# EAGLE design sensormatic (EAGLE 9.5.0)
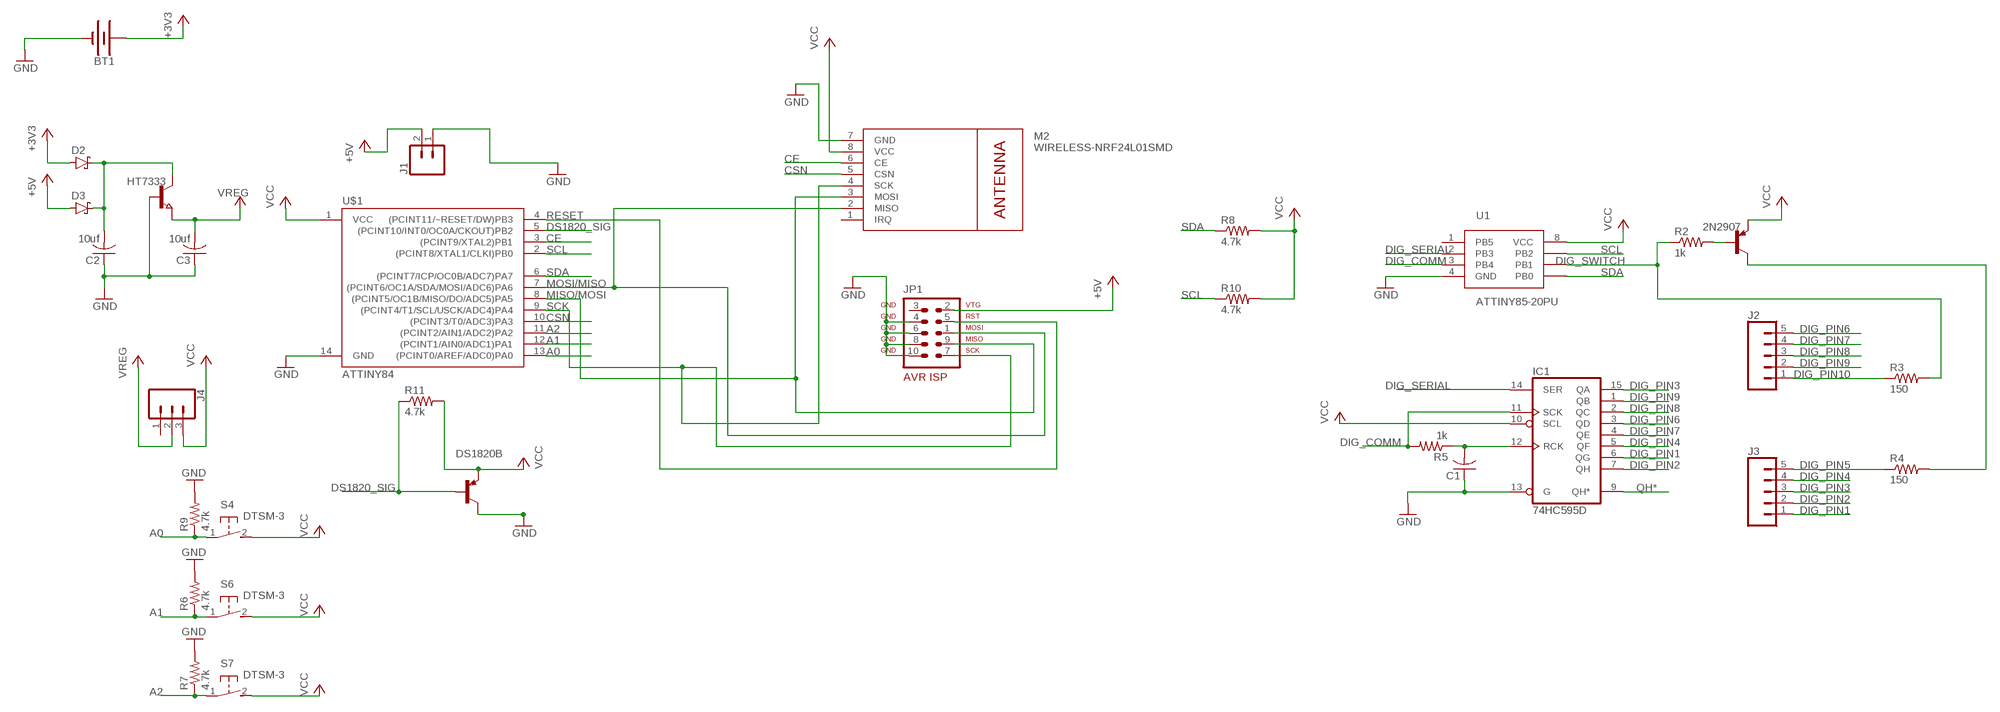
[diagram p0: schematic, sheet 1]

## Parts
2N2907  BCX71SMD  [SOT23]
BT1  BATTERY-20MM_PTH  [BATTCOM_20MM_PTH]
C1  C-USC0603  [C0603]
C2  10uf  C-USC0603  [C0603]
C3  10uf  C-USC0603  [C0603]
D2  SCHOTTKY-DIODESMD  [SMB]
D3  SCHOTTKY-DIODESMD  [SMB]
DS1820B  -PNP-TO92  [TO92]
HT7333  NPN-TRANSISTOR_SOT89  [SOT89]
IC1  74HC595D  [SO16]
J1  CONN_02  [1X02]
J2  CONN_05NO_SILK  [1X05_NO_SILK]
J3  CONN_05NO_SILK  [1X05_NO_SILK]
J4  CONN_03  [1X03]
JP1  AVR-ISP-10  [AVR-ISP-10]
M2  WIRELESS-NRF24L01SMD  [WIRELESS-NRF24L01-SMD]
R2  1k  R-US_R0805  [R0805]
R3  150  R-US_R0805  [R0805]
R4  150  R-US_R0805  [R0805]
R5  1k  R-US_R0805  [R0805]
R6  4.7k  R-US_R0805  [R0805]
R7  4.7k  R-US_R0805  [R0805]
R8  4.7k  R-US_R0805  [R0805]
R9  4.7k  R-US_R0805  [R0805]
R10  4.7k  R-US_R0805  [R0805]
R11  4.7k  R-US_R0805  [R0805]
S4  DTSM-3  [DTSM-3]
S6  DTSM-3  [DTSM-3]
S7  DTSM-3  [DTSM-3]
U1  ATTINY85-20PU  [PDIP-8]
U$1  ATTINY84  [SO14]

## Nets
+3V3: BT1.1(+) D2.A
+5V: D3.A J1.2 JP1.2
A0: R9.1 S4.1 U$1.13((PCINT0/AREF/ADC0)PA0)
A1: R6.1 S6.1 U$1.12((PCINT1/AIN0/ADC1)PA1)
A2: R7.1 S7.1 U$1.11((PCINT2/AIN1/ADC2)PA2)
CE: M2.6(CE) U$1.3((PCINT9/XTAL2)PB1)
CSN: M2.5(CSN) U$1.10((PCINT3/T0/ADC3)PA3)
DIG_COMM: IC1.11(SCK) R5.2 U1.3(PB4)
DIG_PIN1: IC1.6(QG) J3.1
DIG_PIN2: IC1.7(QH) J3.2
DIG_PIN3: IC1.15(QA) J3.3
DIG_PIN4: IC1.5(QF) J3.4
DIG_PIN5: J3.5 R4.1
DIG_PIN6: IC1.3(QD) J2.5
DIG_PIN7: IC1.4(QE) J2.4
DIG_PIN8: IC1.2(QC) J2.3
DIG_PIN9: IC1.1(QB) J2.2
DIG_PIN10: J2.1 R3.1
DIG_SERIAL: IC1.14(SER) U1.2(PB3)
DIG_SWITCH: R2.1 R3.2 U1.6(PB1)
DS1820_SIG: DS1820B.2(B) R11.1 U$1.5((PCINT10/INT0/OC0A/CKOUT)PB2)
GND: BT1.2(-) C1.1 C2.1 C3.1 DS1820B.3(C) HT7333.1(B) IC1.13(G) J1.1 JP1.4 JP1.6 JP1.8 JP1.10 M2.7(GND) R6.2 R7.2 R9.2 U1.4(GND) U$1.14(GND)
MISO/MOSI: JP1.9 M2.3(MOSI) U$1.8((PCINT5/OC1B/MISO/DO/ADC5)PA5)
MOSI/MISO: JP1.1 M2.2(MISO) U$1.7((PCINT6/OC1A/SDA/MOSI/ADC6)PA6)
N$2: C2.2 D2.C D3.C HT7333.2(C)
N$3: 2N2907.1(B) R2.2
N$5: C1.2 IC1.12(RCK) R5.1
N$9: 2N2907.3(C) R4.2
QH*: IC1.9(QH*)
RESET: JP1.5 U$1.4((PCINT11/~RESET/DW)PB3)
SCK: JP1.7 M2.4(SCK) U$1.9((PCINT4/T1/SCL/USCK/ADC4)PA4)
SCL: R10.1 U1.7(PB2) U$1.2((PCINT8/XTAL1/CLKI)PB0)
SDA: R8.1 U1.5(PB0) U$1.6((PCINT7/ICP/OC0B/ADC7)PA7)
VCC: 2N2907.2(E) DS1820B.1(E) IC1.10(SCL) J4.3 M2.8(VCC) R8.2 R10.2 R11.2 S4.2 S6.2 S7.2 U1.8(VCC) U$1.1(VCC)
VREG: C3.2 HT7333.3(E) J4.2 ; supply symbol labelled +3V3, VCC
Unconnected: J4.1 JP1.3 M2.1(IRQ) U1.1(PB5)

## Power pins joined to a net without a drawn wire
GND: IC1.8(GND)
VCC: IC1.16(VCC)

## Library data of the parts
2N2907 = transistor-pnp:BCX71SMD: PNP Transistor
BT1 = SparkFun-Batteries:BATTERY: Battery - Single Cell A variety of battery chemistries, sizes, and footprints. Device List: 20MM_PTH - Coin Cell Battery Holder - 20mm (PTH) <https://www.sparkfun.com/products/783> 6.8MM_PTH - Coin Cell Battery Holder - 6.8MM(SMD) <https://www.digikey.com/product-detail/en/seiko-instruments/MS621FE-FL11E/728-1057-ND/1889208?WT.srch=1&gclid=CNOQ5a6LzdQCFZS2wAodXCkE0g> 12MM_SMD - Coin Cell Battery Holder - 12mm (SMD) <https://www.sparkfun.com/products/10592> 12MM_PTH - Coin Cell Battery Holder - 12mm (PTH) <https://www.sparkfun.com/products/7948> 20MM_SMD - 20mm Coin Cell Battery Holder (SMD) (2 legs) Used on the Big Time Watch Kit <https://www.sparkfun.com/products/11734> 20MM_SMD_4LEGS - Coin Cell Battery Holder - 20mm (SMD) <https://www.sparkfun.com/products/11892> 20MM_SMD_4LEGS_OVERPASTE - Coin Cell Battery Holder - 20mm (SMD) <https://www.sparkfun.com/products/11892> (Over-paste on the legs) 24.5MM_PTH - Coin Cell Battery Holder - 24.5mm (PTH) <https://www.sparkfun.com/products/8863> 9V - 9V Battery Holder - PC Mount Used on the SparkFun SparkPunk Sound Kit <https://www.sparkfun.com/products/11177> and SparkFun SparkPunk Sequencer Kit <https://www.sparkfun.com/products/12707> 18650 - Battery Holder - 18650 (PTH) <https://www.sparkfun.com/products/13113> AA - Battery Holder - 1xAA (PTH) <https://www.sparkfun.com/products/7949> AAA - Battery Holder - 1xAAA (PTH) <https://www.sparkfun.com/products/12718> AA_KIT - Battery Holder - 1xAA (PTH) <https://www.sparkfun.com/products/7949> Special kit package - pads only have exposed copper on one side of the board. AAA_KIT - Battery Holder - 1xAAA (PTH) <https://www.sparkfun.com/products/12718> Special kit package - pads only have exposed copper on one side of the board.; PROD_ID: BATT-09031; SF_SKU: PRT-00783
C1-C3 = rcl:C-US: CAPACITOR, American symbol; SPICEPREFIX: C
D2 D3 = diode:SCHOTTKY-DIODE: Schottky Diode
DS1820B = transistor:*-PNP-: PNP Transistror
HT7333 = semicon-smd-ipc:NPN-TRANSISTOR_: NPN TRANSISTOR
IC1 = 74xx-eu:74*595: 8-bit SHIFT REGISTER, output latch
J1 = SparkFun-Connectors:CONN_02: Multi connection point. Often used as Generic Header-pin footprint for 0.1 inch spaced/style header connections On any of the 0.1 inch spaced packages, you can populate with these: Break Away Headers - Straight <https://www.sparkfun.com/products/116> (PRT-00116) Break Away Male Headers - Right Angle <https://www.sparkfun.com/products/553> (PRT-00553) Female Headers <https://www.sparkfun.com/products/115> (PRT-00115) Break Away Headers - Machine Pin <https://www.sparkfun.com/products/117> (PRT-00117) Break Away Female Headers - Swiss Machine Pin <https://www.sparkfun.com/products/743> (PRT-00743) For SCREWTERMINALS and SPRING TERMINALS visit here: Screw Terimnals on SparkFun.com <https://www.sparkfun.com/search/results?term=Screw+Terminals> (5mm/3.5mm/2.54mm spacing) This device is also useful as a general connection point to wire up your design to another part of your project. Our various solder wires solder well into these plated through hole pads. Hook-Up Wire - Assortment (Stranded, 22 AWG) <https://www.sparkfun.com/products/11375> (PRT-11375) Hook-Up Wire - Assortment (Solid Core, 22 AWG) <https://www.sparkfun.com/products/11367> (PRT-11367) View the entire wire category on our website here <https://www.sparkfun.com/categories/141> Special notes: Molex polarized connector foot print use with: PRT-08233 with associated crimp pins and housings. 2.54_SCREWTERM for use with PRT-10571. 3.5mm Screw Terminal footprints for PRT-08084 5mm Screw Terminal footprints for use with PRT-08432
J2 J3 = SparkFun-Connectors:CONN_05: Multi connection point. Often used as Generic Header-pin footprint for 0.1 inch spaced/style header connections On any of the 0.1 inch spaced packages, you can populate with these: Break Away Headers - Straight <https://www.sparkfun.com/products/116> (PRT-00116) Break Away Male Headers - Right Angle <https://www.sparkfun.com/products/553> (PRT-00553) Female Headers <https://www.sparkfun.com/products/115> (PRT-00115) Break Away Headers - Machine Pin <https://www.sparkfun.com/products/117> (PRT-00117) Break Away Female Headers - Swiss Machine Pin <https://www.sparkfun.com/products/743> (PRT-00743) For SCREWTERMINALS and SPRING TERMINALS visit here: Screw Terimnals on SparkFun.com <https://www.sparkfun.com/search/results?term=Screw+Terminals> (5mm/3.5mm/2.54mm spacing) This device is also useful as a general connection point to wire up your design to another part of your project. Our various solder wires solder well into these plated through hole pads. Hook-Up Wire - Assortment (Stranded, 22 AWG) <https://www.sparkfun.com/products/11375> (PRT-11375) Hook-Up Wire - Assortment (Solid Core, 22 AWG) <https://www.sparkfun.com/products/11367> (PRT-11367) View the entire wire category on our website here <https://www.sparkfun.com/categories/141> Special notes: Molex polarized connector foot print use with SKU : PRT-08231 with associated crimp pins and housings. 1MM SMD Version SKU: PRT-10208
J4 = SparkFun-Connectors:CONN_03: Multi connection point. Often used as Generic Header-pin footprint for 0.1 inch spaced/style header connections On any of the 0.1 inch spaced packages, you can populate with these: Break Away Headers - Straight <https://www.sparkfun.com/products/116> (PRT-00116) Break Away Male Headers - Right Angle <https://www.sparkfun.com/products/553> (PRT-00553) Female Headers <https://www.sparkfun.com/products/115> (PRT-00115) Break Away Headers - Machine Pin <https://www.sparkfun.com/products/117> (PRT-00117) Break Away Female Headers - Swiss Machine Pin <https://www.sparkfun.com/products/743> (PRT-00743) Stackable Header - 3 Pin (Female, 0.1") <https://www.sparkfun.com/products/13875> (PRT-13875) For SCREWTERMINALS and SPRING TERMINALS visit here: Screw Terimnals on SparkFun.com <https://www.sparkfun.com/search/results?term=Screw+Terminals> (5mm/3.5mm/2.54mm spacing) This device is also useful as a general connection point to wire up your design to another part of your project. Our various solder wires solder well into these plated through hole pads. Hook-Up Wire - Assortment (Stranded, 22 AWG) <https://www.sparkfun.com/products/11375> (PRT-11375) Hook-Up Wire - Assortment (Solid Core, 22 AWG) <https://www.sparkfun.com/products/11367> (PRT-11367) View the entire wire category on our website here <https://www.sparkfun.com/categories/141> Special notes: Molex polarized connector foot print use with SKU : PRT-08232 with associated crimp pins and housings.
JP1 = atmel:AVR-ISP-10: AVR ISP-10 Serial Programming Header
M2 = nrf24l01-smd:WIRELESS-NRF24L01: 2.4 GHz Wireless Module based on NRF24L01 chip
R2-R11 = rcl:R-US_: RESISTOR, American symbol; SPICEPREFIX: R
S4 S6 S7 = switch-tact:DTSM-3
U1 = Microcontroller:ATTINY85-20PU: IC MCU 8BIT 8KB FLASH 8DIP Manufacturer's datasheet <http://ww1.microchip.com/downloads/en/DeviceDoc/Atmel-2586-AVR-8-bit-Microcontroller-ATtiny25-ATtiny45-ATtiny85_Datasheet-Summary.pdf>; CREATED_BY: PCBLayout.com; DIGI_KEY_PART_NUMBER: ATTINY85-20PU-ND; MANUFACTURER: Microchip Technology; MPN: ATTINY85-20PU; PACKAGE: 8-PDIP
U$1 = SparkFun-IC-Microcontroller:ATTINY84: Atmel 14-pin 2/4/8kB flash uC Datasheet <https://cdn.sparkfun.com/datasheets/Widgets/doc8006.pdf> SparkFun Products Tiny AVR Programmer <https://www.sparkfun.com/products/11801> (PGM-11801) SparkFun Servo Trigger - Continuous Rotation <https://www.sparkfun.com/products/13872> (WIG-13872) SparkFun Servo Trigger <https://www.sparkfun.com/products/13118> (WIG-13118); PROD_ID: IC-11285

## Board
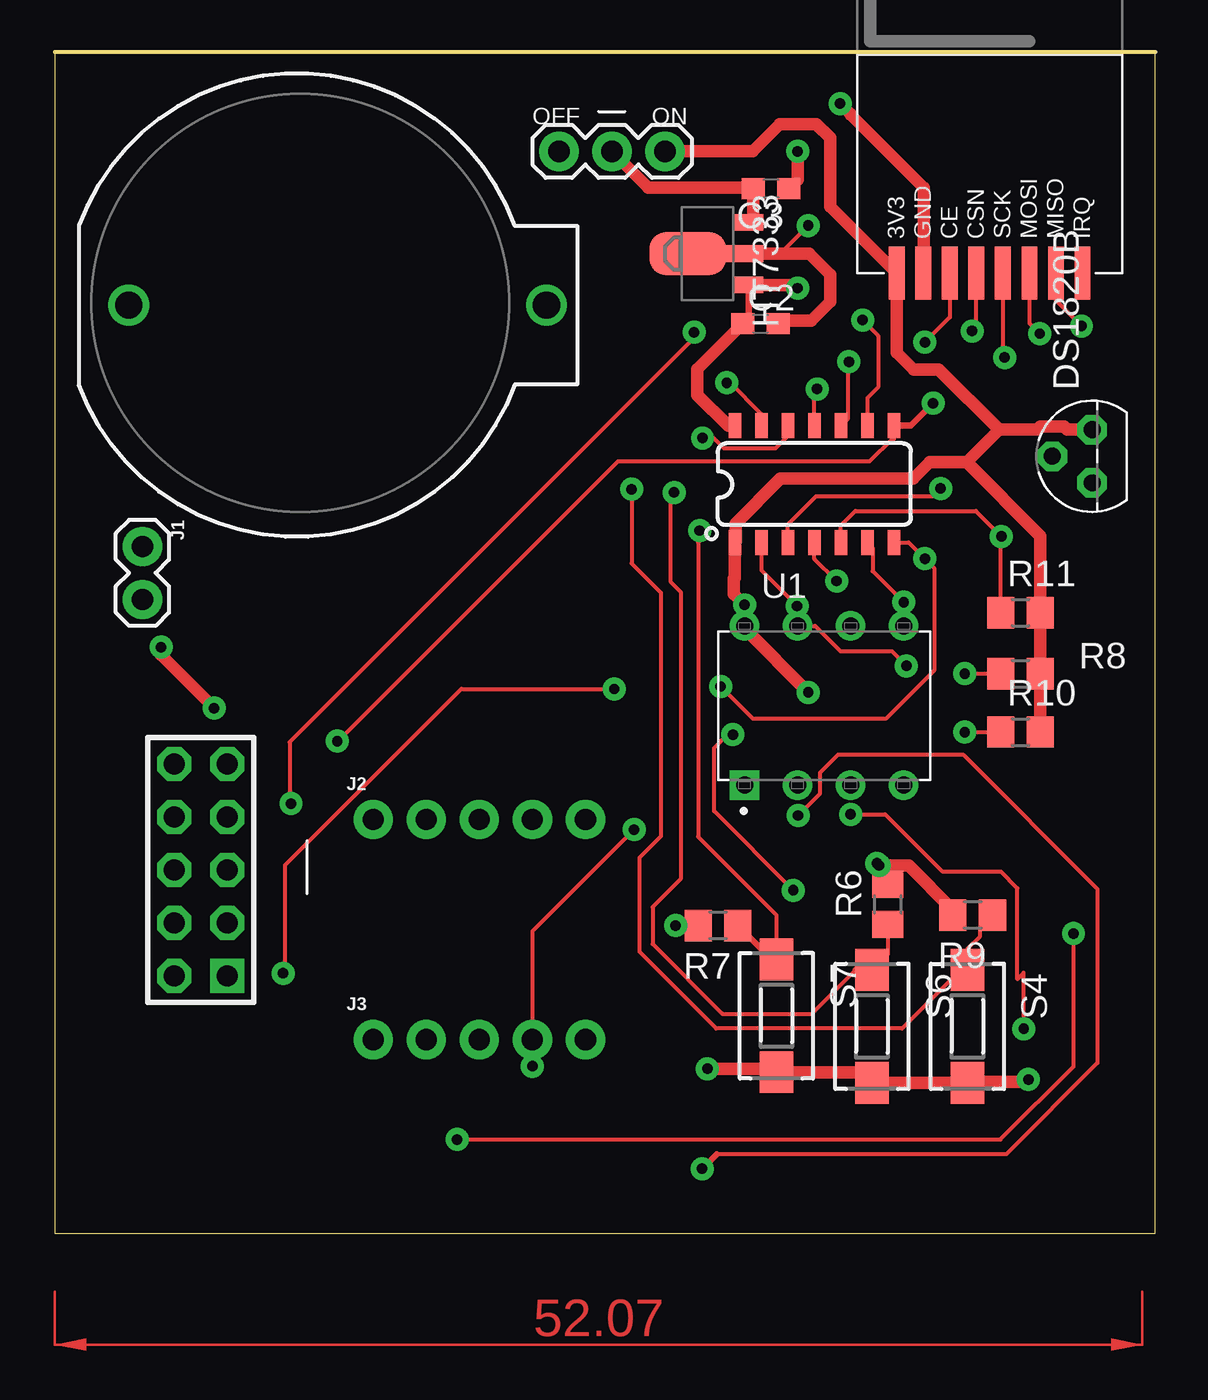
[diagram p1: board, top side]
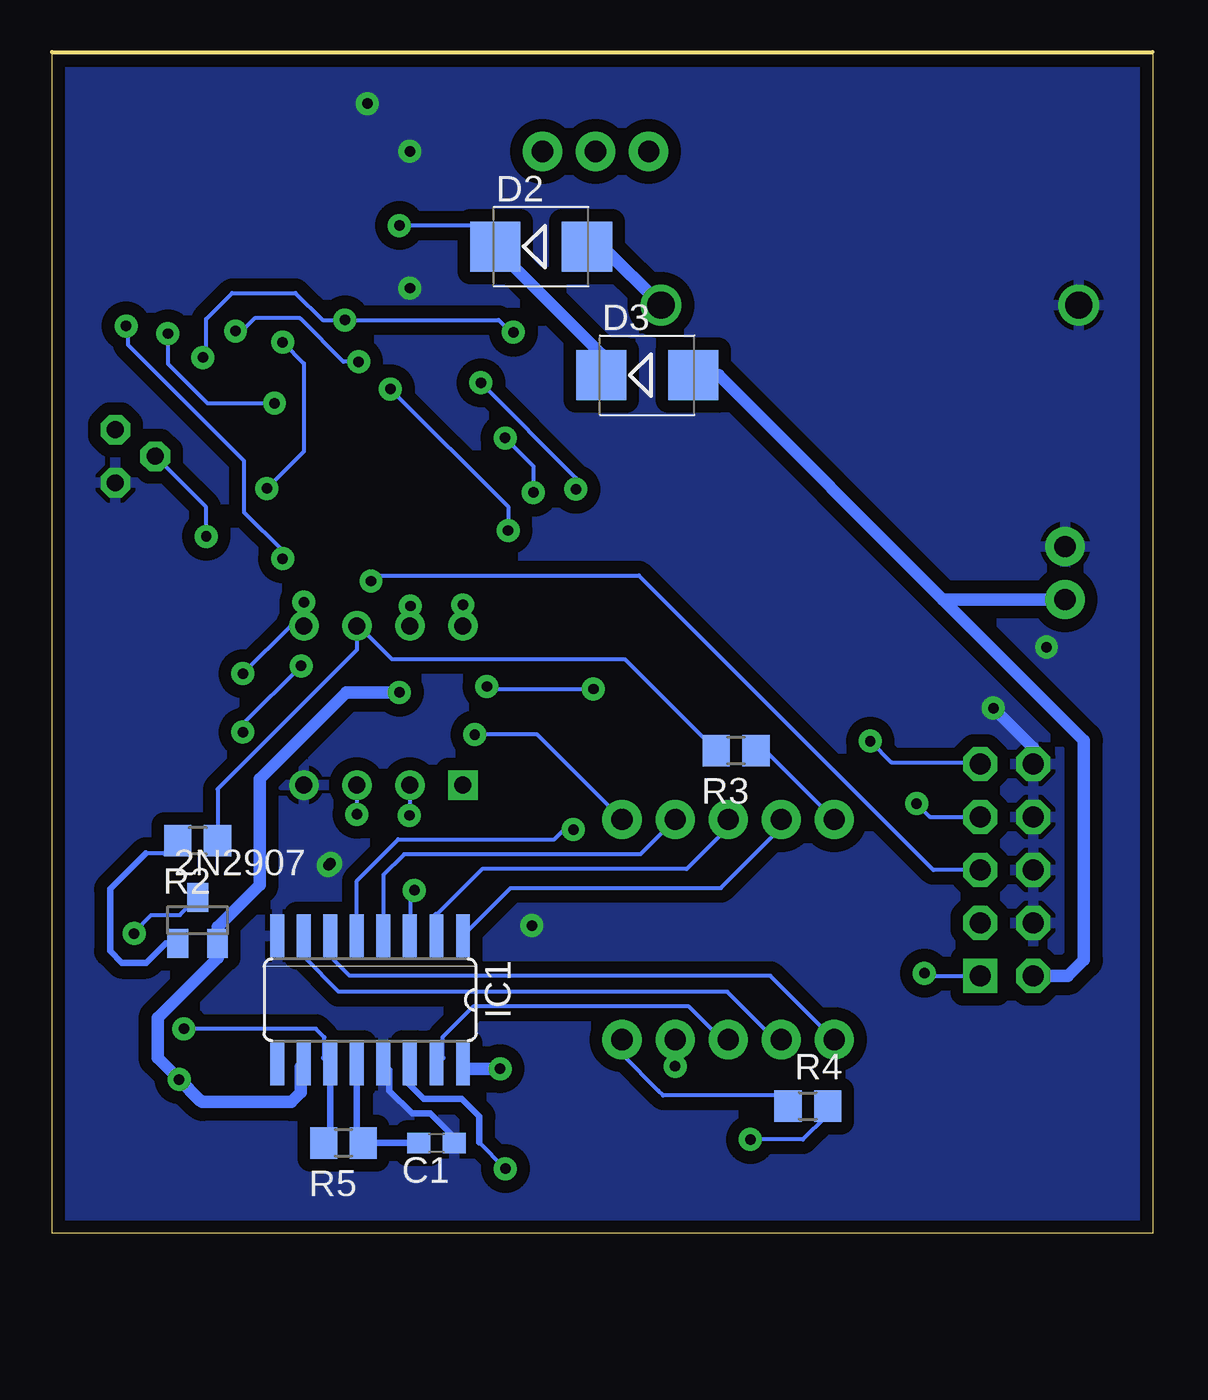
[diagram p2: board, bottom side, seen from below]

Size 52.68 x 56.57 mm. Coordinates in mm from the lower left corner, seen from the top.
Outline: 0,0 52.68,0 52.68,56.57 0,56.57 0,0
Copper layers (1*16): Top 0.035mm / dielectric 1.5mm / Bottom 0.035mm
Design rules "kraken-labs-rev5-post-casamatic": minimum track width 0.2mm, minimum drill 0.5mm, track to track 0.4mm, track to pad 0.4mm, pad to pad 0.4mm, via to via 0.4mm, smd to smd 0.2mm, copper to edge 0.3mm, drill to drill 6mil, minimum pad ring 0.3mm, minimum via ring 0.3mm, stop-mask expansion 4mil, vias tented up to drill 0mil, thermal gap 10mil

### Footprints (pad centres in the part's own frame; a part is rotated, then mirrored left to right if it is on the bottom)
SOT23 = smd 1 x 1.4: 1 -0.95,-1.1; 2 0.95,-1.1; 3 0,1.1
BATTCOM_20MM_PTH = drill 1.3: 1 11.85,0; 2 -8.15,0
C0603 = smd 1.1 x 1: 1 -0.85,0; 2 0.85,0
SMB = smd 2.4 x 2.4: A 2.2,0; C -2.2,0
TO92 = drill 0.813 octagon: 1 1.27,0; 2 0,1.905; 3 -1.27,0
SOT89 = smd 0.8 x 1.4: 1 -1.499,-1.981; 3 1.499,-1.981 | smd 0.8 x 1.9: 2 0,-1.727 | smd 2.032 x 3.65: 2@1 0,0.94
SO16 = smd 0.66 x 2.032: 1 -4.445,-3.073; 2 -3.175,-3.073; 3 -1.905,-3.073; 4 -0.635,-3.073; 5 0.635,-3.073; 6 1.905,-3.073; 7 3.175,-3.073; 8 4.445,-3.073; 9 4.445,3.073; 10 3.175,3.073; 11 1.905,3.073; 12 0.635,3.073; 13 -0.635,3.073; 14 -1.905,3.073; 15 -3.175,3.073; 16 -4.445,3.073
1X02 = drill 1.016 pad 1.88: 1 0,0; 2 2.54,0
1X05_NO_SILK = drill 1.016 pad 1.88: 1 0,0; 2 2.54,0; 3 5.08,0; 4 7.62,0; 5 10.16,0
1X03 = drill 1.016 pad 1.88: 1 0,0; 2 2.54,0; 3 5.08,0
AVR-ISP-10 = drill 1.016 square: 1 -5.08,-1.27 | drill 1.016 octagon: 2 -5.08,1.27; 3 -2.54,-1.27; 4 -2.54,1.27; 5 0,-1.27; 6 0,1.27; 7 2.54,-1.27; 8 2.54,1.27; 9 5.08,-1.27; 10 5.08,1.27
WIRELESS-NRF24L01-SMD = smd 2.54 x 0.762: 1 1.27,0; 2 1.27,1.27; 3 1.27,2.54; 4 1.27,3.81; 5 1.27,5.08; 6 1.27,6.35; 7 1.27,7.62; 8 1.27,8.89
R0805 = smd 1.3 x 1.5: 1 -0.95,0; 2 0.95,0
DTSM-3 = smd 2 x 1.6: 1 -2.7,0; 2 2.7,0
PDIP-8 = drill 0.813 pad 1.219 square: 1 -3.81,-3.81 | drill 0.813 pad 1.219: 2 -1.27,-3.81; 3 1.27,-3.81; 4 3.81,-3.81; 5 3.81,3.81; 6 1.27,3.81; 7 -1.27,3.81; 8 -3.81,3.81
SO14 = smd 0.6 x 1.2: 1 -3.175,-2.8; 2 -1.905,-2.8; 3 -0.635,-2.8; 4 0.635,-2.8; 5 1.905,-2.8; 6 3.175,-2.8; 7 4.445,-2.8; 8 4.445,2.8; 9 3.175,2.8; 10 1.905,2.8; 11 0.635,2.8; 12 -0.635,2.8; 13 -1.905,2.8; 14 -3.175,2.8

### Placement (x,y rotation side)
2N2907  45.72,14.99 0 bottom
BT1  11.68,44.45 0 top
C1  34.29,4.32 180 bottom
C2  33.78,43.56 0 top
C3  34.29,50.04 180 top
D2  29.28,47.26 0 bottom
D3  24.2,41.1 0 bottom
DS1820B  49.66,37.21 90 top
HT7333  31.23,46.92 90 top
IC1  37.46,11.18 180 bottom
J1  4.19,32.89 270 top
J2  15.24,19.81 0 top
J3  15.24,9.27 0 top
J4  24.13,51.82 0 top
JP1  6.99,17.4 90 top
M2  49.2,44.71 90 top
R2  45.72,18.8 180 bottom
R3  19.94,23.11 180 bottom
R4  16.51,6.1 0 bottom
R5  38.73,4.32 180 bottom
R6  39.88,15.75 90 top
R7  31.75,14.73 180 top
R8  46.23,26.8 0 top
R9  43.94,15.24 180 top
R10  46.23,24 0 top
R11  46.23,29.72 0 top
S4  43.69,9.91 270 top
S6  39.12,9.91 270 top
S7  34.54,10.41 270 top
U1  36.83,25.27 0 top
U$1  35.73,35.89 0 top

### Tracks (layer width: path | path; a pad name or v marks a point on that pad's centre or on a via)
+3V3
  Bottom 0.61: BT1.1 26.34,47.26 D2.A
+5V
  Bottom 0.61: JP1.2 4.06,12.32 3.29,13.09 3.29,23.61 10.04,30.35 | J1.2 9.65,30.35 10.04,30.35 | 10.04,30.35 20.78,41.1 D3.A
A0  (via drill 0.5)
  Top 0.2: U$1.13 33.82,39.24 32.33,40.73 v32.16,40.73 | 43.36,12.61 40.56,9.81 31.66,9.81 27.99,13.48 27.99,17.99 29.01,19.01 29.01,30.68 27.61,32.08 v27.61,35.64 | R9.1 44.29,14.64 44.29,14.22 43.69,13.61 S4.1
  Top 0.305: 43.36,12.61 S4.1
  Bottom 0.2: v32.16,40.73 27.61,36.18 v27.61,35.64
A1  (via drill 0.5, 0.5 pad 0.55)
  Top 0.2: v29.65,35.48 29.65,35.44 29.46,35.25 29.46,31.22 29.96,30.72 29.96,16.96 28.62,15.62 28.62,13.85 31.95,10.51 36.24,10.51 38.34,12.61 | R6.1 39.88,13.37 S6.1 | U$1.12 35.09,38.18 34.5,37.59 32.04,37.59 31.54,38.09 v31.01,38.09
  Top 0.305: 38.34,12.61 S6.1
  Bottom 0.2: v31.01,38.09 29.65,36.73 v29.65,35.48
A2  (via drill 0.5)
  Top 0.2: U$1.11 36.36,40.3 | v30.86,33.66 30.86,33.15 30.8,33.08 30.8,18.99 34.54,15.25 S7.1
  Top 0.305: 36.36,40.3 v36.49,40.44 | S7.1 34.32,13.11 R7.1
  Bottom 0.2: v36.49,40.44 30.86,34.8 v30.86,33.66
CE  (via drill 0.5)
  Top 0.2: v42.41,35.68 42.02,35.29 36.44,35.29 35.09,33.95 U$1.3 | M2.6 42.85,43.87 v41.66,42.67
  Bottom 0.2: v41.66,42.67 40.64,41.66 40.64,37.44 v42.41,35.68
CSN  (via drill 0.5)
  Top 0.2: 37.95,41.67 37.95,39 U$1.10 | M2.5 44.12,43.42 v43.91,43.21
  Top 0.305: v38.02,41.74 37.95,41.67
  Bottom 0.2: v38.02,41.74 38.74,41.74 40.82,43.82 43,43.82 43.61,43.21 v43.91,43.21
DIG_COMM  (via drill 0.5)
  Top 0.2: v46.39,9.79 46.39,12.47 46.08,12.17 46.08,16.52 45.3,17.3 42.51,17.3 39.75,20.07 v38.1,20.07
  Bottom 0.2: 39.66,8.39 39.66,9.39 40.06,9.79 v46.39,9.79 | U1.3 v38.1,20.07
  Bottom 0.305: R5.2 39.37,4.63 IC1.11 39.66,8.39
DIG_PIN1
  Bottom 0.2: IC1.6 39.37,13.25 38.45,12.33 18.3,12.33 J3.1
DIG_PIN2
  Bottom 0.2: IC1.7 40.64,13.25 38.96,11.57 20.37,11.57 18.07,9.27
  Bottom 0.305: J3.2 18.07,9.27
DIG_PIN3
  Bottom 0.2: 34,8.39 34,9.39 32.53,10.86 22.2,10.86 20.61,9.27
  Bottom 0.305: 34,8.39 IC1.15 | J3.3 20.61,9.27
DIG_PIN4  (via drill 0.5)
  Top 0.2: v27.73,19.34 22.86,14.46 v22.86,8
  Bottom 0.2: 27.95,19.55 28.64,18.86 36.12,18.86 38.1,16.88 IC1.5
  Bottom 0.305: v27.73,19.34 27.95,19.55 | J3.4 v22.86,8
DIG_PIN5
  Bottom 0.2: J3.5 25.4,8.56 23.66,6.82 23.44,6.6 17.96,6.6
  Bottom 0.3: R4.1 17.96,6.6
DIG_PIN6  (via drill 0.5)
  Top 0.2: v32.46,23.88 32.2,23.88 31.56,23.24 31.56,20.21 v35.35,16.43
  Bottom 0.2: J2.5 29.46,23.88 v32.46,23.88 | 35.53,14.28 35.53,16.15 35.35,16.33
  Bottom 0.305: IC1.3 35.53,14.28 | 35.35,16.33 v35.35,16.43
DIG_PIN7
  Bottom 0.2: J2.4 24.52,18.15 35.84,18.15 36.83,17.15 IC1.4
DIG_PIN8
  Bottom 0.2: 34.29,15.25 32.1,17.44 22.31,17.44 20.32,19.43
  Bottom 0.305: 34.29,15.25 IC1.2 | J2.3 20.32,19.43
DIG_PIN9
  Bottom 0.2: 17.78,19.43 20.68,16.54 30.73,16.54 IC1.1
  Bottom 0.305: J2.2 17.78,19.43
DIG_PIN10
  Bottom 0.2: R3.1 18.54,23.11 J2.1
DIG_SERIAL  (via drill 0.5)
  Top 0.2: 31.69,3.79 45.55,3.79 49.92,8.15 49.92,16.49 43.48,22.92 37.5,22.92 36.64,22.07 36.64,21.07 v35.58,20.01
  Top 0.305: 31.69,3.79 v30.99,3.09
  Bottom 0.2: U1.2 35.56,20.03 | v30.99,3.09 32.24,4.34
  Bottom 0.305: 35.56,20.03 v35.58,20.01 | 32.24,4.34 32.24,5.6 33.08,6.43 34.89,6.43 35.56,7.1 IC1.14
DIG_SWITCH
  Bottom 0.2: U1.6 38.1,27.94 44.77,21.27 R2.1 | 38,29.08 36.42,27.5 25.27,27.5 R3.2
  Bottom 0.305: U1.6 38,29.08
DS1820_SIG  (via drill 0.5)
  Top 0.2: U$1.5 37.63,33.89 38.33,34.59 44.09,34.59 v45.31,33.37 45.28,33.34 R11.1
  Bottom 0.2: v45.31,33.37 45.31,34.77 DS1820B.2
GND  (via drill 0.5)
  Top 0.2: 42.99,15.6 40.88,17.71 v39.36,17.71
  Top 0.305: 32.23,38.69 U$1.14 | HT7333.1 33.21,43.84 C2.1 | R9.2 42.99,15.49 42.99,15.6 | 30.61,14.73 R7.2
  Top 0.61: HT7333.1 35.56,45.42 v35.56,45.27 | C3.1 35.56,50.46 v35.56,51.82 | v37.59,54.1 38.1,53.59 38.1,53.58 41.6,50.08 41.6,45.99 M2.7 | C2.1 30.76,41.39 30.76,40.15 32.23,38.69 | v5.08,28.07 5.08,27.69 v7.62,25.15 | v29.72,14.73 30.61,14.73 | R6.2 39.88,17.19 v39.46,17.61 40.87,17.61 42.99,15.49
  Bottom 0.305: IC1.13 36.54,7.81 36.54,6.82 35.46,5.73 34.58,5.73 33.44,4.59 C1.1
  Bottom 0.61: JP1.10 5.71,23.24 v7.62,25.15
  pour Bottom (isolate 0.61): 0,56.9 52.7,56.9 52.7,0 0,0
MISO/MOSI  (via drill 0.5)
  Top 0.2: M2.3 46.66,43.58 v47.15,43.09 | v13.52,23.57 13.56,23.57 26.95,36.96 39,36.96 40.11,38.07
  Top 0.305: v42.04,39.75 40.98,38.69 U$1.8 40.17,38.18 40.11,38.11 40.11,38.07
  Bottom 0.2: v47.15,43.09 47.15,41.64 45.26,39.75 v42.04,39.75 | v13.52,23.57 12.5,22.55 8.33,22.55 JP1.9
MOSI/MISO  (via drill 0.5)
  Top 0.2: U$1.7 40.88,33.09 v41.66,32.31 42.1,31.86 42.1,26.95 39.78,24.63 33.43,24.63 v31.88,26.19 | v10.92,12.45 11.01,12.53 11.01,17.61 19.46,26.07 v26.78,26.07 | v49.15,43.46 47.93,44.68 M2.2
  Bottom 0.2: v41.66,32.31 41.66,32.69 43.5,34.54 43.5,37 49.06,42.55 49.06,43.37 | 31.88,26.07 v26.78,26.07 | v10.92,12.45 10.79,12.32 JP1.1
  Bottom 0.305: v49.15,43.46 49.06,43.37 | v31.88,26.19 31.88,26.07
N$2  (via drill 0.5)
  Top 0.2: v36.07,48.26 34.72,46.92 HT7333.2
  Top 0.61: C2.2 34.78,43.71 36.2,43.71 37.11,44.62 37.11,45.91 36.11,46.92 HT7333.2
  Bottom 0.2: D2.C 32.48,48.26 v36.07,48.26
  Bottom 0.61: D3.C 26.4,42.11 31.48,47.19 D2.C
N$3
  Bottom 0.2: 47.27,18.2 48.21,18.2
  Bottom 0.305: R2.2 47.27,18.2 | 48.21,18.2 49.92,16.49 49.92,13.52 49.35,12.95 48.19,12.95 47.25,13.89 2N2907.1
N$5
  Bottom 0.305: C1.2 R5.1 38.1,4.63 IC1.12
N$9  (via drill 0.5)
  Top 0.2: v19.26,4.49 45.26,4.49 48.77,8 v48.77,14.35
  Bottom 0.2: 15.65,5.58 16.74,4.49 v19.26,4.49 | 2N2907.3 46.57,15.24 47.95,15.24 48.77,14.42
  Bottom 0.305: R4.2 15.65,6.01 15.65,5.58 | v48.77,14.35 48.77,14.42
RESET  (via drill 0.5)
  Top 0.2: v37.42,31.24 36.36,32.3 U$1.4
  Bottom 0.2: 37.16,31.5 24.59,31.5 10.49,17.4 JP1.5
  Bottom 0.305: 37.16,31.5 v37.42,31.24
SCK  (via drill 0.5)
  Top 0.2: M2.4 45.39,42.02 | U$1.9 38.9,40.01 39.42,40.52 39.42,42.99 v38.67,43.74 | v11.3,20.57 11.23,20.64 11.23,23.52 30.61,42.89 v30.61,43.16
  Top 0.305: 45.39,42.02 v45.47,41.94
  Bottom 0.2: v45.47,41.94 45.31,42.1 45.31,43.79 44.07,45.03 41.04,45.03 39.74,43.74 v38.67,43.74 31.32,43.74 30.73,43.16 v30.61,43.16 | v11.3,20.57 10.67,19.94 JP1.7
SCL  (via drill 0.5)
  Top 0.2: U$1.2 33.82,31.76 v35.54,30.04 | U1.7 36.39,29.08 37.6,27.88 40.07,27.88 v40.77,27.18 | v43.56,24 R10.1
  Bottom 0.2: U1.7 35.54,29.11 v35.54,30.04 | v40.77,27.18 43.56,24.38 v43.56,24
SDA  (via drill 0.5)
  Top 0.2: U$1.6 39.15,32.83 39.15,31.71 v40.64,30.23 | v43.56,26.8 R8.1
  Bottom 0.2: v40.64,30.23 U1.5 41.27,29.08 v43.56,26.8
VCC  (via drill 0.5)
  Top 0.61: J4.3 33.41,51.82 34.71,53.12 36.46,53.12 37.11,52.46 37.11,49.17 M2.8 40.31,42.17 41.12,41.36 42.33,41.36 45.21,38.48 | v36.07,25.91 33.02,28.96 v33.02,30.1 32.51,30.61 32.51,31.35 32.55,31.38 U$1.1 32.59,33.12 32.59,33.99 34.74,36.14 41.1,36.14 41.89,36.93 43.66,36.93 | v46.61,7.37 46.48,7.24 43.72,7.24 S4.2 S6.2 38.61,7.71 S7.2 34.38,7.87 v31.24,7.87 | 45.21,38.48 43.66,36.93 | 43.66,36.93 47.18,33.4 47.18,33.39 R11.2 R8.2 R10.2 | DS1820B.1 48.48,38.48 48.34,38.62 47.17,38.62 47.03,38.48 45.21,38.48
  Bottom 0.61: v36.07,25.91 38.6,25.91 42.76,21.75 42.76,16.68 44.77,14.67 2N2907.2 44.77,13.18 47.64,10.31 47.64,8.4 v46.61,7.37 45.62,6.38 45.59,6.38 45.49,6.28 41.25,6.28 40.77,6.75 40.77,7.97 IC1.10 | U1.8 v33.02,30.1 | IC1.16 32.79,7.87 v31.24,7.87
VREG
  Top 0.61: HT7333.3 33.44,48.64 C3.2 33.41,50.07 28.41,50.07 J4.2
(copper drawn outside any net)
  shapes: Top area x2

### Text on the board
tPlace: OFF | ON